# EAGLE schematic ptschematic (EAGLE 9.0.1)
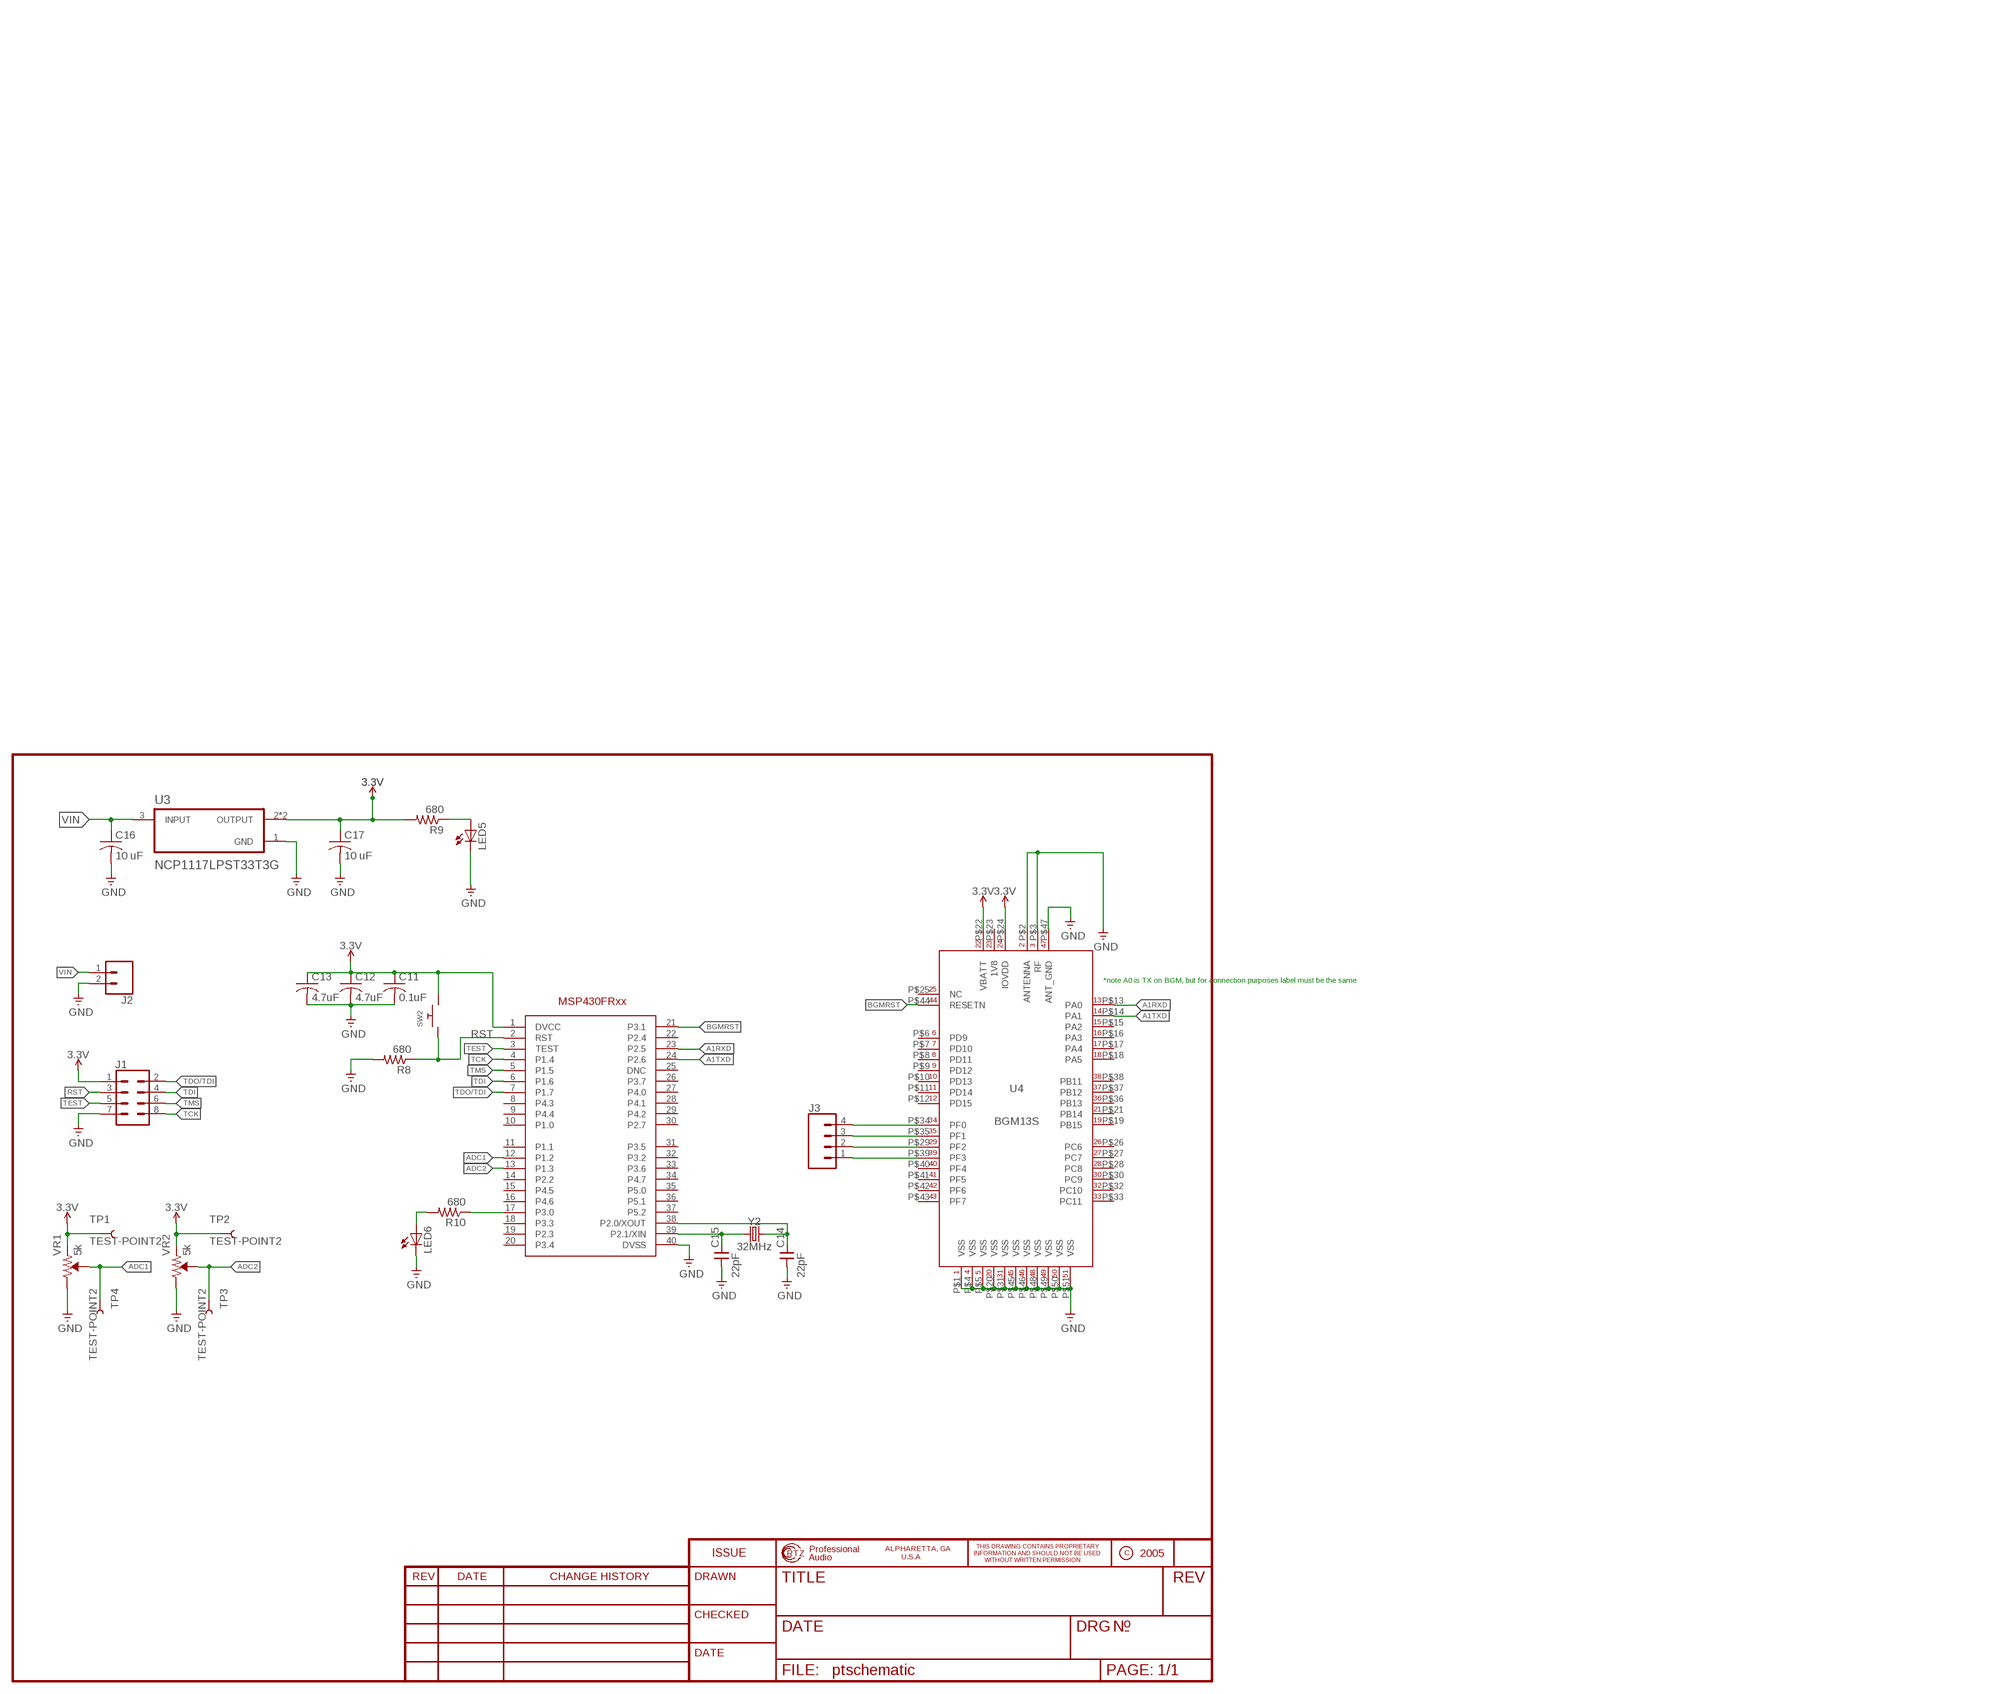
[diagram p0: schematic, sheet 1]

## Parts
C11  0.1uF  C-USC0805  [C0805]
C12  4.7uF  C-USC0805  [C0805]
C13  4.7uF  C-USC0805  [C0805]
C14  22pF  CNP-0805  [0805]
C15  22pF  CNP-0805  [0805]
C16  10 uF  C-USC0805  [C0805]
C17  10 uF  C-USC0805  [C0805]
J1  CONN_04X2  [2X4]
J2  CONN_02  [1X02]
J3  CONN_04  [1X04]
LED5  LEDCHIPLED_0805  [CHIPLED_0805]
LED6  LEDCHIPLED_0805  [CHIPLED_0805]
R8  680  R-US_R0805  [R0805]
R9  680  R-US_R0805  [R0805]
R10  680  R-US_R0805  [R0805]
SW2  SWITCH_PUSHBUTTONEVQ-PE  [TACT_PANA-EVQ]
TP1  TEST-POINT2  [PAD.02X.02]
TP2  TEST-POINT2  [PAD.02X.02]
TP3  TEST-POINT2  [PAD.02X.02]
TP4  TEST-POINT2  [PAD.02X.02]
U3  NCP1117LPST33T3G  [SOT230P700X175-4N]
U4  BGM13S  [BGM13S]
U$1  MSP340FR247  [QFN-40]
VR1  5k  TRIMPOT-SMD-5MM-CLOSED-1/4W-20%  [TRIMPOT-SMD-5MM]
VR2  5k  TRIMPOT-SMD-5MM-CLOSED-1/4W-20%  [TRIMPOT-SMD-5MM]
Y2  32MHz  CRYSTAL-32MHZ-SMD-2.0X1.6MM  [CRYSTAL-SMD-2.0X1.6MM]

## Nets
3.3V: C11.1 C12.1 C13.1 C17.1 J1.1 R9.2 SW2.P$2 TP1.P$1 TP2.P$1 U3.2(OUTPUT) U3.4(OUTPUT) U4.P$22(VBATT) U4.P$24(IOVDD) U$1.1(DVCC) VR1.A(CCW) VR2.A(CCW)
A1RXD: U4.P$13(PA0) U$1.23(P2.5)
A1TXD: U4.P$14(PA1) U$1.24(P2.6)
ADC1: TP4.P$1 U$1.12(P1.2) VR1.B(WIPER)
ADC2: TP3.P$1 U$1.13(P1.3) VR2.B(WIPER)
BGMRST: U4.P$44(RESETN) U$1.21(P3.1)
GND: C11.2 C12.2 C13.2 C14.1 C15.1 C16.2 C17.2 J1.7 J2.2 LED5.C LED6.C R8.2 U3.1(GND) U4.P$1(VSS) U4.P$2(ANTENNA) U4.P$3(RF) U4.P$4(VSS) U4.P$5(VSS) U4.P$20(VSS) U4.P$31(VSS) U4.P$45(VSS) U4.P$46(VSS) U4.P$47(ANT_GND) U4.P$48(VSS) U4.P$49(VSS) U4.P$50(VSS) U4.P$51(VSS) U$1.40(DVSS) VR1.C(CW) VR2.C(CW)
N$1: J3.4 U4.P$34(PF0)
N$2: J3.3 U4.P$35(PF1)
N$3: J3.2 U4.P$29(PF2)
N$4: J3.1 U4.P$39(PF3)
N$10: LED5.A R9.1
N$11: C14.2 U$1.38(P2.0/XOUT) Y2.3
N$16: C15.2 U$1.39(P2.1/XIN) Y2.1
N$17: R10.1 U$1.17(P3.0)
N$18: LED6.A R10.2
RST: J1.3 R8.1 SW2.P$1 U$1.2(RST)
TCK: J1.8 U$1.4(P1.4)
TDI: J1.4 U$1.6(P1.6)
TDO/TDI: J1.2 U$1.7(P1.7)
TEST: J1.5 U$1.3(TEST)
TMS: J1.6 U$1.5(P1.5)
VIN: C16.1 J2.1 U3.3(INPUT)
Unconnected: U4.P$6(PD9) U4.P$7(PD10) U4.P$8(PD11) U4.P$9(PD12) U4.P$10(PD13) U4.P$11(PD14) U4.P$12(PD15) U4.P$15(PA2) U4.P$16(PA3) U4.P$17(PA4) U4.P$18(PA5) U4.P$19(PB15) U4.P$21(PB14) U4.P$25(NC) U4.P$26(PC6) U4.P$27(PC7) U4.P$28(PC8) U4.P$30(PC9) U4.P$32(PC10) U4.P$33(PC11) U4.P$36(PB13) U4.P$37(PB12) U4.P$38(PB11) U4.P$40(PF4) U4.P$41(PF5) U4.P$42(PF6) U4.P$43(PF7) U$1.8(P4.3) U$1.9(P4.4) U$1.10(P1.0) U$1.11(P1.1) U$1.14(P2.2) U$1.15(P4.5) U$1.16(P4.6) U$1.18(P3.3) U$1.19(P2.3) U$1.20(P3.4) U$1.22(P2.4) U$1.25(DNC) U$1.26(P3.7) U$1.27(P4.0) U$1.28(P4.1) U$1.29(P4.2) U$1.30(P2.7) U$1.31(P3.5) U$1.32(P3.2) U$1.33(P3.6) U$1.34(P4.7) U$1.35(P5.0) U$1.36(P5.1) U$1.37(P5.2)

## Notes on the sheet
- *note A0 is TX on BGM, but for connection purposes label must be the same

## Power pins joined to a net without a drawn wire
1V8: U4.P$23(1V8)

## Library data of the parts
C11-C13 C16 C17 = adafruit:C-US: CAPACITOR, American symbol
C14 C15 = cap-master:CNP-: NON-POLARIZED CAP
J1 = SparkFun-Connectors:CONN_04X2: Multi connection point. Often used as Generic Header-pin footprint for 0.1 inch spaced/style header connections On any of the 0.1 inch spaced packages, you can populate with these: Break Away Headers - Straight <https://www.sparkfun.com/products/116> (PRT-00116) Break Away Male Headers - Right Angle <https://www.sparkfun.com/products/553> (PRT-00553) Female Headers <https://www.sparkfun.com/products/115> (PRT-00115) Break Away Headers - Machine Pin <https://www.sparkfun.com/products/117> (PRT-00117) Break Away Female Headers - Swiss Machine Pin <https://www.sparkfun.com/products/743> (PRT-00743)
J2 = SparkFun-Connectors:CONN_02: Multi connection point. Often used as Generic Header-pin footprint for 0.1 inch spaced/style header connections On any of the 0.1 inch spaced packages, you can populate with these: Break Away Headers - Straight <https://www.sparkfun.com/products/116> (PRT-00116) Break Away Male Headers - Right Angle <https://www.sparkfun.com/products/553> (PRT-00553) Female Headers <https://www.sparkfun.com/products/115> (PRT-00115) Break Away Headers - Machine Pin <https://www.sparkfun.com/products/117> (PRT-00117) Break Away Female Headers - Swiss Machine Pin <https://www.sparkfun.com/products/743> (PRT-00743) For SCREWTERMINALS and SPRING TERMINALS visit here: Screw Terimnals on SparkFun.com <https://www.sparkfun.com/search/results?term=Screw+Terminals> (5mm/3.5mm/2.54mm spacing) This device is also useful as a general connection point to wire up your design to another part of your project. Our various solder wires solder well into these plated through hole pads. Hook-Up Wire - Assortment (Stranded, 22 AWG) <https://www.sparkfun.com/products/11375> (PRT-11375) Hook-Up Wire - Assortment (Solid Core, 22 AWG) <https://www.sparkfun.com/products/11367> (PRT-11367) View the entire wire category on our website here <https://www.sparkfun.com/categories/141> Special notes: Molex polarized connector foot print use with: PRT-08233 with associated crimp pins and housings. 2.54_SCREWTERM for use with PRT-10571. 3.5mm Screw Terminal footprints for PRT-08084 5mm Screw Terminal footprints for use with PRT-08432
J3 = SparkFun-Connectors:CONN_04: Multi connection point. Often used as Generic Header-pin footprint for 0.1 inch spaced/style header connections On any of the 0.1 inch spaced packages, you can populate with these: Break Away Headers - Straight <https://www.sparkfun.com/products/116> (PRT-00116) Break Away Male Headers - Right Angle <https://www.sparkfun.com/products/553> (PRT-00553) Female Headers <https://www.sparkfun.com/products/115> (PRT-00115) Break Away Headers - Machine Pin <https://www.sparkfun.com/products/117> (PRT-00117) Break Away Female Headers - Swiss Machine Pin <https://www.sparkfun.com/products/743> (PRT-00743) For SCREWTERMINALS and SPRING TERMINALS visit here: Screw Terimnals on SparkFun.com <https://www.sparkfun.com/search/results?term=Screw+Terminals> (5mm/3.5mm/2.54mm spacing) This device is also useful as a general connection point to wire up your design to another part of your project. Our various solder wires solder well into these plated through hole pads. Hook-Up Wire - Assortment (Stranded, 22 AWG) <https://www.sparkfun.com/products/11375> (PRT-11375) Hook-Up Wire - Assortment (Solid Core, 22 AWG) <https://www.sparkfun.com/products/11367> (PRT-11367) View the entire wire category on our website here <https://www.sparkfun.com/categories/141> Special notes: Molex polarized connector foot print use with SKU : PRT-08231 with associated crimp pins and housings. 1MM SMD Version SKU: PRT-10208; PROD_ID: CONN-09696
LED5 LED6 = adafruit:LED: LED OSRAM: - CHIPLED LG R971, LG N971, LY N971, LG Q971, LY Q971, LO R971, LY R971 LH N974, LH R974 LS Q976, LO Q976, LY Q976 LO Q996 - Hyper CHIPLED LW Q18S LB Q993, LB Q99A, LB R99A - SideLED LS A670, LO A670, LY A670, LG A670, LP A670 LB A673, LV A673, LT A673, LW A673 LH A674 LY A675 LS A676, LA A676, LO A676, LY A676, LW A676 LS A679, LY A679, LG A679 - Hyper Micro SIDELED® LS Y876, LA Y876, LO Y876, LY Y876 LT Y87S - SmartLED LW L88C, LW L88S LB L89C, LB L89S, LG L890 LS L89K, LO L89K, LY L89K LS L896, LA L896, LO L896, LY L896 - TOPLED LS T670, LO T670, LY T670, LG T670, LP T670 LSG T670, LSP T670, LSY T670, LOP T670, LYG T670 LG T671, LOG T671, LSG T671 LB T673, LV T673, LT T673, LW T673 LH T674 LS T676, LA T676, LO T676, LY T676, LB T676, LH T676, LSB T676, LW T676 LB T67C, LV T67C, LT T67C, LS T67K, LO T67K, LY T67K, LW E67C LS E67B, LA E67B, LO E67B, LY E67B, LB E67C, LV E67C, LT E67C LW T67C LS T679, LY T679, LG T679 LS T770, LO T770, LY T770, LG T770, LP T770 LB T773, LV T773, LT T773, LW T773 LH T774 LS E675, LA E675, LY E675, LS T675 LS T776, LA T776, LO T776, LY T776, LB T776 LHGB T686 LT T68C, LB T68C - Hyper Mini TOPLED® LB M676 - Mini TOPLED Santana® LG M470 LS M47K, LO M47K, LY M47K Source: http://www.osram.convergy.de/
R8-R10 = adafruit:R-US_: RESISTOR, American symbol
SW2 = adafruit:SWITCH_PUSHBUTTON: Buttons SOFTTOUCHSMD_SJ - Soft touch temporary push button (Super Junk Akihabara) Compatible with SKPMANE010 [Mouser: 688-SKPMAN] C&K_KSS = Digikey: KSS221GLFS
TP1-TP4 = SparkFun-Connectors:TEST-POINT: SparkFun Test Points Bare copper test points for troubleshooting or In-Circuit-Testing. These are used by our Production team for verifying production board runs using pogo-pins on test beds. SparkFun Products: SparkFun LSM9DS1 Breakout <https://www.sparkfun.com/products/13284> SparkFun PSOC <https://www.sparkfun.com/products/13714> SparkFun Load Cell Amplifier <https://www.sparkfun.com/products/13879>
U3 = NCP1117LPST33T3G:NCP1117LPST33T3G: None; AVAILABILITY: Unavailable; DESCRIPTION: Linear Voltage Regulator, Positive, LDO, 1.0 A _Fixed and Adjustable_ Vout: 3.3 V; MF: ON Semiconductor; MP: NCP1117LPST33T3G; PACKAGE: SOT-223 ON Semiconductor; PRICE: None
U4 = BMES-Spr2019:BGM13S
U$1 = ti_msp430fr247:MSP340FR247
VR1 VR2 = SparkFun-Resistors:TRIMPOT: Trimming Potentiometer (Trimpot) Three-terminal potentiometers, with an adjustable wiper and two adjustable resistors. A pot can be used to create a configurable voltage divider, or as a variable resistor. "Trimpots" are a subset of potentiometers, usually intended for "set-and-forget" applications. They're often more delicate than standard potentiometers - rated for fewer turns. Variants PTH-KNOB - PTH Trimpot w/ finger-adjustable knob Trimpot 10K with Knob <https://www.sparkfun.com/products/9806> (COM-09806) Datasheet <http://www.sparkfun.com/datasheets/Components/General/TSR-3386.pdf> SMD-3MM-CLOSED-FRAME - SMD 3mm Square Closed-Frame Trimpot Used on e.g. EasyDriver - Stepper Motor Driver <https://www.sparkfun.com/products/12779> Datasheet <http://www.bitechnologies.com/pdfs/22.pdf> (22AR10KTR) SMD-5MM - SMD 5mm Square Closed-Frame Trimpot Used on e.g. IOIO-OTG - V2.2 <https://www.sparkfun.com/products/13613> Datasheet <http://www.vishay.com/docs/51008/ts53.pdf> (TS53YL502MR10) SMD-3MM-1/10W-25% - 3mm Square Open-Frame Trimpot Used on e.g. SparkFun Shapeoko <https://www.sparkfun.com/products/13899> Datasheet <http://www.bourns.com/docs/Product-Datasheets/TC33.pdf> (TC33X-2-103E); PROD_ID: RES-11156
Y2 = SparkFun-Clocks:CRYSTAL-32MHZ: 32MHz Crystal Digikey Example <http://www.digikey.com/product-detail/en/murata-electronics-north-america/XRCGB32M000F2P00R0/490-9769-1-ND/4952013> Frequency: 32MHz Frequency Stability: ±20ppm Frequency Tolerance: ±20ppm Load Capacitance: 6pF SparkFun Products SparkFun nRF52832 Breakout <https://www.sparkfun.com/products/13990>; PROD_ID: XTAL-13459